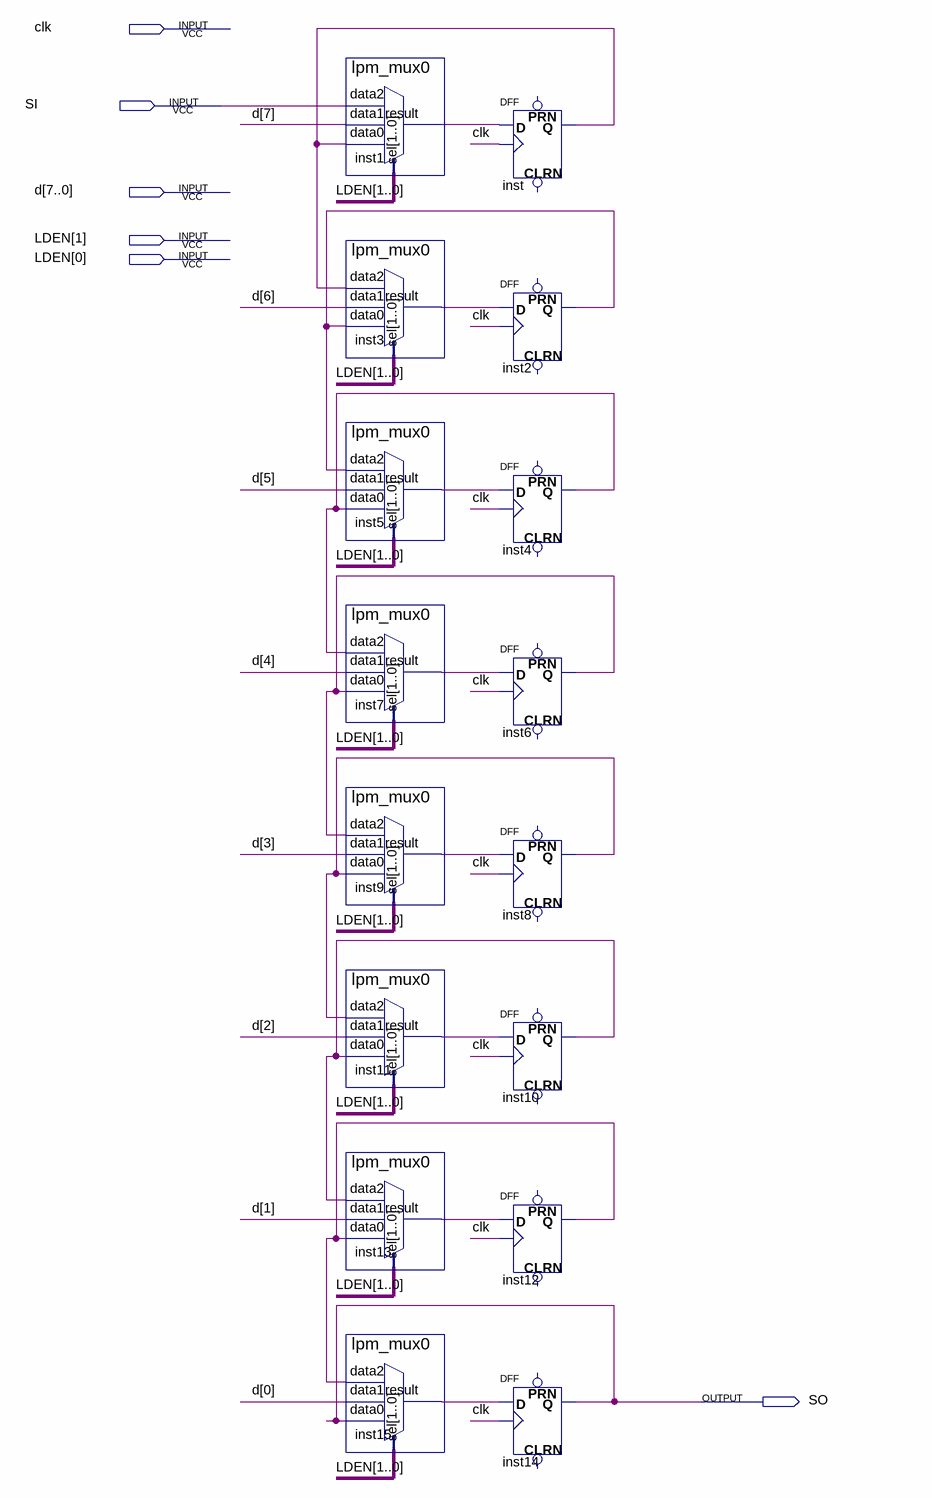
[diagram p0: schematic sheet]
// Quartus schematic piso8.bdf as structural Verilog: 16 symbols, 6 pins
module piso8 (
  input  clk,
  input  SI,
  input  [7:0] d,
  input  [1:0] LDEN,
  output SO
);

  wire inst1_result, inst2_q, inst3_result, inst4_q, inst5_result, inst6_q, inst7_result, inst8_q,
       inst9_result, inst10_q, inst11_result, inst12_q, inst13_result, inst15_result, inst_q;

  lpm_mux0 inst1 (.data2(SI), .data1(d[7]), .data0(inst_q), .sel(LDEN), .result(inst1_result));
  lpm_mux0 inst3 (.data2(inst_q), .data1(d[6]), .data0(inst2_q), .sel(LDEN), .result(inst3_result));
  lpm_mux0 inst5 (.data2(inst2_q), .data1(d[5]), .data0(inst4_q), .sel(LDEN), .result(inst5_result));
  lpm_mux0 inst7 (.data2(inst4_q), .data1(d[4]), .data0(inst6_q), .sel(LDEN), .result(inst7_result));
  lpm_mux0 inst9 (.data2(inst6_q), .data1(d[3]), .data0(inst8_q), .sel(LDEN), .result(inst9_result));
  lpm_mux0 inst11 (.data2(inst8_q), .data1(d[2]), .data0(inst10_q), .sel(LDEN), .result(inst11_result));
  lpm_mux0 inst13 (.data2(inst10_q), .data1(d[1]), .data0(inst12_q), .sel(LDEN), .result(inst13_result));
  lpm_mux0 inst15 (.data2(inst12_q), .data1(d[0]), .data0(SO), .sel(LDEN), .result(inst15_result));
  DFF inst (.CLK(clk), .D(inst1_result), .Q(inst_q));  // open: CLRN, PRN
  DFF inst2 (.CLK(clk), .D(inst3_result), .Q(inst2_q));  // open: CLRN, PRN
  DFF inst4 (.CLK(clk), .D(inst5_result), .Q(inst4_q));  // open: CLRN, PRN
  DFF inst6 (.CLK(clk), .D(inst7_result), .Q(inst6_q));  // open: CLRN, PRN
  DFF inst8 (.CLK(clk), .D(inst9_result), .Q(inst8_q));  // open: CLRN, PRN
  DFF inst10 (.CLK(clk), .D(inst11_result), .Q(inst10_q));  // open: CLRN, PRN
  DFF inst12 (.CLK(clk), .D(inst13_result), .Q(inst12_q));  // open: CLRN, PRN
  DFF inst14 (.CLK(clk), .D(inst15_result), .Q(SO));  // open: CLRN, PRN
endmodule
